# Altium schematic sheet MainBoard.SchDoc
size A; SheetNumber: 1; SheetTotal: 7
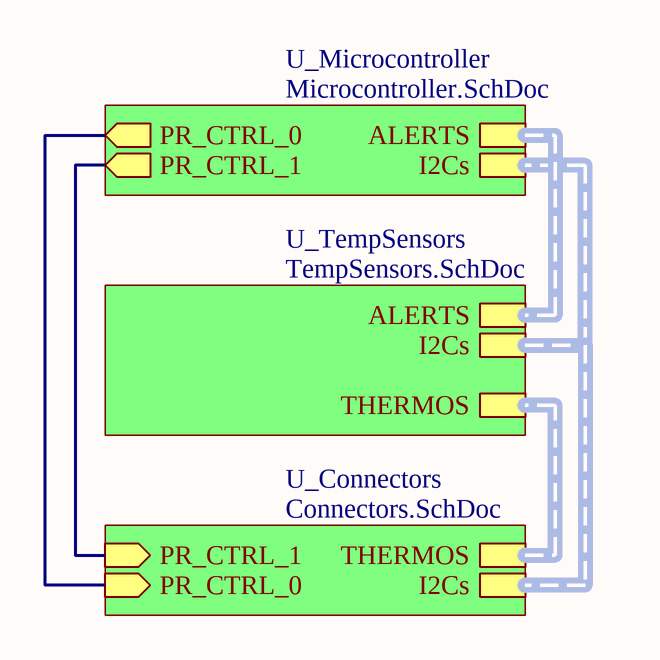
[diagram p0: MainBoard.SchDoc]

## Sub-sheets
U_Connectors = Connectors.SchDoc: THERMOS (harness THERMOS), PR_CTRL_0 (in), I2Cs (harness I2C_M), PR_CTRL_1 (in)
U_Microcontroller = Microcontroller.SchDoc: I2Cs (harness I2C_M), ALERTS (harness ALERT), PR_CTRL_0 (out), PR_CTRL_1 (out)
U_TempSensors = TempSensors.SchDoc: I2Cs (harness I2C_M), ALERTS (harness ALERT), THERMOS (harness ALERT)

## Nets
(unnamed): sheet U_Microcontroller/PR_CTRL_0, sheet U_Connectors/PR_CTRL_0
(unnamed): sheet U_Microcontroller/PR_CTRL_1, sheet U_Connectors/PR_CTRL_1

## Buses and harness runs
harness sheet U_Connectors/I2Cs = sheet U_Microcontroller/I2Cs = sheet U_TempSensors/I2Cs
harness sheet U_Connectors/THERMOS = sheet U_TempSensors/THERMOS
harness sheet U_Microcontroller/ALERTS = sheet U_TempSensors/ALERTS